# EAGLE design si4735v2.3.1 (EAGLE 9.4.2)
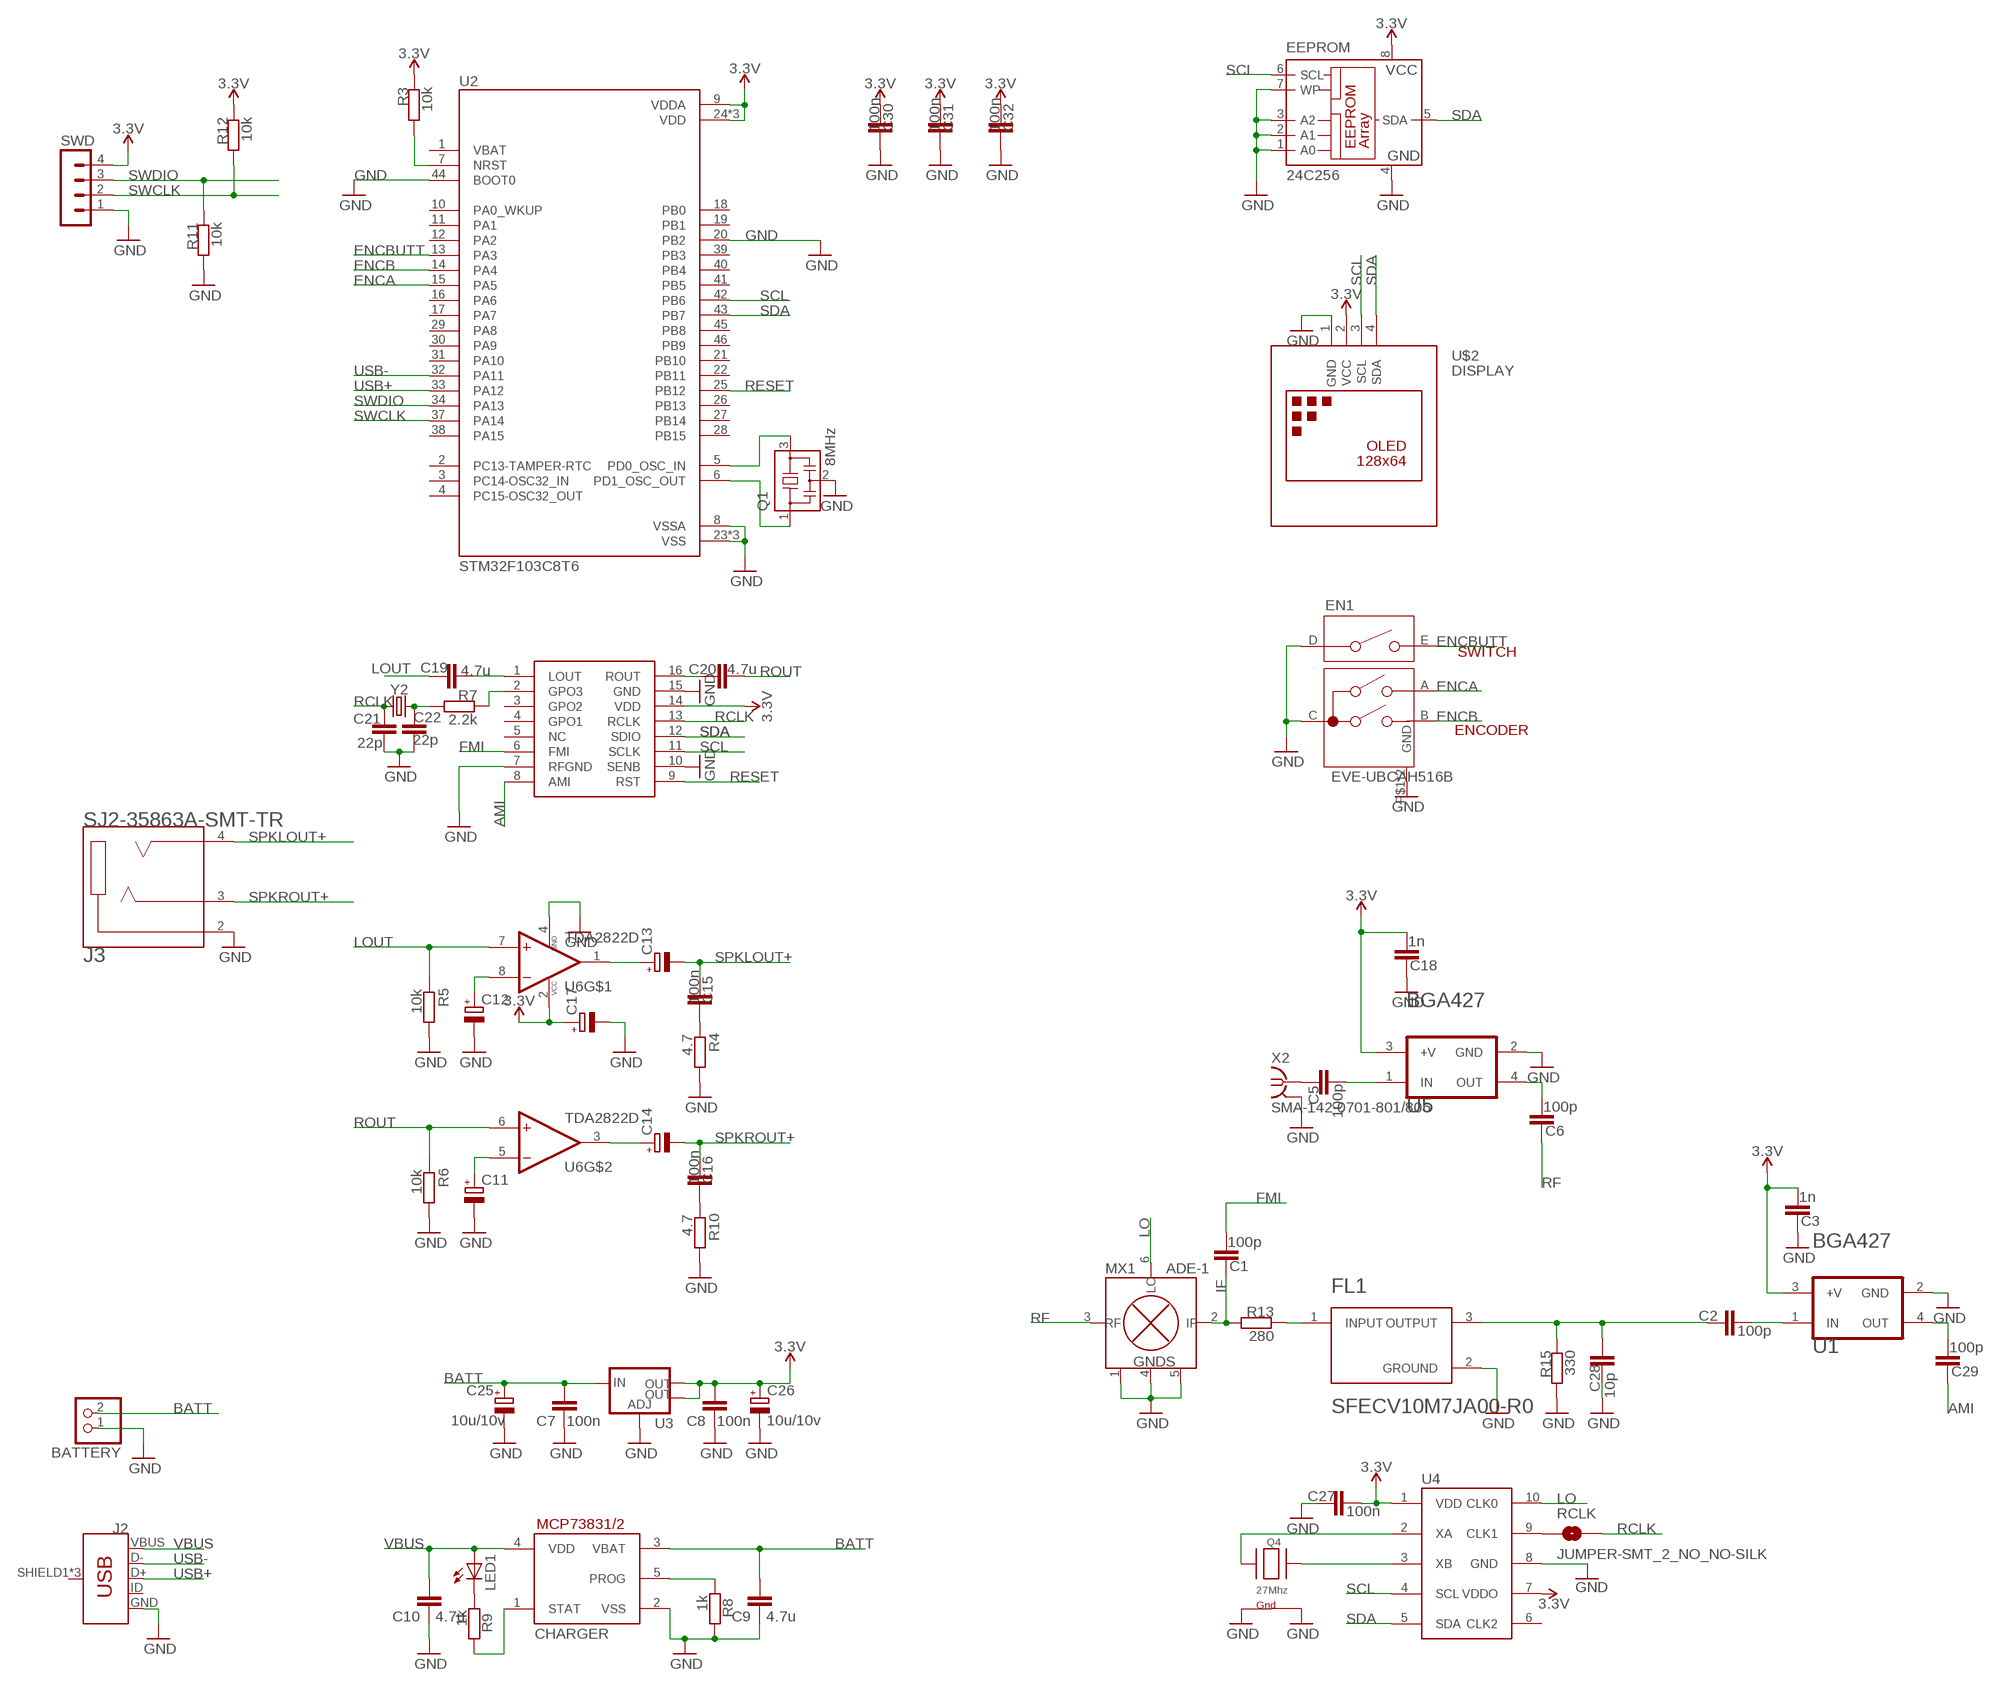
[diagram p0: schematic, sheet 1]

## Parts
BATTERY  PINHD-1X2  [1X02]
C1  100p  C-EUC0805  [C0805]
C2  100p  C-EUC0805  [C0805]
C3  1n  C-EUC0805  [C0805]
C5  100p  C-EUC0805  [C0805]
C6  100p  C-EUC0805  [C0805]
C7  100n  C-EUC0805  [C0805]
C8  100n  C-EUC0805  [C0805]
C9  4.7u  C-EUC0805  [C0805]
C10  4.7u  C-EUC0805  [C0805]
C11  CPOL-EUSMCB  [SMC_B]
C12  CPOL-EUSMCB  [SMC_B]
C13  CPOL-EUSMCB  [SMC_B]
C14  CPOL-EUSMCB  [SMC_B]
C15  100n  C-EUC0805  [C0805]
C16  100n  C-EUC0805  [C0805]
C17  CPOL-EUSMCA  [SMC_A]
C18  1n  C-EUC0805  [C0805]
C19  4.7u  C-EUC0805  [C0805]
C20  4.7u  C-EUC0805  [C0805]
C21  22p  C-EUC0805  [C0805]
C22  22p  C-EUC0805  [C0805]
C25  10u/10v  CPOL-EUA/3216-18W  [A/3216-18W]
C26  10u/10v  CPOL-EUA/3216-18W  [A/3216-18W]
C27  100n  C-EUC0805  [C0805]
C28  10p  C-EUC0805  [C0805]
C29  100p  C-EUC0805  [C0805]
C30  100n  C-EUC0805  [C0805]
C31  100n  C-EUC0805  [C0805]
C32  100n  C-EUC0805  [C0805]
CHARGER  MCP73831/OT  [SOT23-5L]
EEPROM  24C256  24C64SM  [SO-08M]
EN1  EVE-UBCAH516B  [EVE-UBCAH516B]
FL1  MURATA_ELECTRONICS_NORTH_AMERICA_SFECV10M7JA00-R0MURATA_ELECTRONICS_NORTH_AMERICA_SFECV10M7JA00-R0_0_0  [MURATA_ELECTRONICS_NORTH_AMERICA_SFECV10M7JA00-R0_0]
J2  USB_MICRO-BREDUCED_PASTE  [USB-B-MICRO-SMD_RED_PASTE]
J3  SJ2-35863A-SMT-TR  [CUI_SJ2-35863A-SMT-TR]
LED1  LED3MM  [LED3MM]
MX1  ADE-1  [CD636]
Q1  8MHz  CSTCR6M00G53Z  [CSTCR6M]
Q4  27Mhz  XTAL-4-3225  [NX3225]
R3  10k  R-EU_R0805  [R0805]
R4  4.7  R-EU_R0805  [R0805]
R5  10k  R-EU_R0805  [R0805]
R6  10k  R-EU_R0805  [R0805]
R7  2.2k  R-EU_R0805  [R0805]
R8  1k  R-EU_R0805  [R0805]
R9  1k  R-EU_R0805  [R0805]
R10  4.7  R-EU_R0805  [R0805]
R11  10k  R-EU_R0805  [R0805]
R12  10k  R-EU_R0805  [R0805]
R13  280  R-EU_R0805  [R0805]
R15  330  R-EU_R0805  [R0805]
RCLK  JUMPER-SMT_2_NO_NO-SILK  [SMT-JUMPER_2_NO_NO-SILK]
SI4732-A10  SI4732  [SOIC127P600X175-16N]
SWD  MA04-1  [MA04-1]
U1  INFINEON_BGA427INFINEON_BGA427_0_0  [INFINEON_BGA427_0]
U2  STM32F103C8T6  [QFP50P900X900X160-48N]
U3  V_REG_LM1117SOT223  [SOT223]
U4  SI5351A_CLOCK_GEN  [MSOP-10]
U5  INFINEON_BGA427INFINEON_BGA427_0_0  [INFINEON_BGA427_0]
U6  TDA2822D  [SOIC127P600X175-8N]
U$2  DISPLAY  DISPLAY-OLED-128X64-I2C  [DISPLAY-OLED-128X64-I2C]
X2  SMA-142-0701-801/806  [J502-ND-142-0701-801/806]
Y2  CRYSTALSMD-3.2X1.5  [CRYSTAL-SMD-3.2X1.5MM]

## Nets
3.3V: C3.1 C8.2 C17.+ C18.1 C26.+ C27.1 C30.2 C31.2 C32.2 EEPROM.8(VCC) R3.1 R12.1 SI4732-A10.14(VDD) SWD.4 U1.3(+V) U2.9(VDDA) U2.24(VDD) U2.36(VDD) U2.48(VDD) U3.2(OUT) U3.4(OUT) U4.1(VDD) U4.7(VDDO) U5.3(+V) U6.2(VCC) U$2.2(VCC)
AMI: C29.2 SI4732-A10.8(AMI)
BATT: BATTERY.2 C7.2 C9.2 C25.+ CHARGER.3(VBAT) U3.3(IN)
ENCA: EN1.A U2.15(PA5)
ENCB: EN1.B U2.14(PA4)
ENCBUTT: EN1.E U2.13(PA3)
FILTER: C2.2 C28.1 FL1.3(OUTPUT) R15.1
FMI: C1.1 SI4732-A10.6(FMI)
GND: BATTERY.1 C3.2 C7.1 C8.1 C9.1 C10.1 C11.- C12.- C17.- C18.2 C21.1 C22.1 C25.- C26.- C27.2 C28.2 C30.1 C31.1 C32.1 CHARGER.2(VSS) EEPROM.1(A0) EEPROM.2(A1) EEPROM.3(A2) EEPROM.4(GND) EEPROM.7(WP) EN1.C EN1.D EN1.P$1(GND) EN1.P$2(GND) FL1.2(GROUND) J2.GND J3.2(SLEEVE) MX1.1(GND) MX1.4(GND) MX1.5(GND) Q1.2 Q4.2(G2) Q4.4(G1) R4.2 R5.2 R6.2 R8.2 R10.2 R11.2 R15.2 SI4732-A10.7(RFGND) SI4732-A10.10(SENB) SI4732-A10.15(GND) SWD.1 U1.2(GND) U2.8(VSSA) U2.20(PB2) U2.23(VSS) U2.35(VSS) U2.44(BOOT0) U2.47(VSS) U3.1(ADJ) U4.8(GND) U5.2(GND) U6.4(GND) U$2.1(GND) X2.G@1 X2.G@2 X2.G@3 X2.G@4
IF: C1.2 MX1.2(IF) R13.2
LO: MX1.6(LO) U4.10(CLK0)
LOUT: C19.2 R5.1 U6.7(1IN+)
N$1: Q1.3 U2.5(PD0_OSC_IN)
N$2: Q1.1 U2.6(PD1_OSC_OUT)
N$3: CHARGER.5(PROG) R8.1
N$4: C2.1 U1.1(IN)
N$5: RCLK.1 U4.9(CLK1)
N$6: C6.1 U5.4(OUT)
N$7: C5.1 U5.1(IN)
N$9: C12.+ U6.8(1IN-)
N$10: C11.+ U6.5(2IN-)
N$11: Q4.3(X2) U4.3(XB)
N$12: C14.+ U6.3(2OUT)
N$13: Q4.1(X1) U4.2(XA)
N$14: C13.+ U6.1(1OUT)
N$15: C15.1 R4.1
N$16: C19.1 SI4732-A10.1(LOUT)
N$17: C20.1 SI4732-A10.16(ROUT)
N$18: C22.2 R7.2 Y2.P$2
N$19: C16.1 R10.1
N$20: R7.1 SI4732-A10.2(GPO3)
N$21: C5.2 X2.1
N$24: LED1.K(C) R9.1
N$25: CHARGER.1(STAT) R9.2
N$26: C29.1 U1.4(OUT)
N$28: FL1.1(INPUT) R13.1
N$29: R3.2 U2.7(NRST)
RCLK: C21.2 RCLK.2 SI4732-A10.13(RCLK) Y2.P$1
RESET: SI4732-A10.9(RST) U2.25(PB12)
RF: C6.2 MX1.3(RF)
ROUT: C20.2 R6.1 U6.6(2IN+)
SCL: EEPROM.6(SCL) SI4732-A10.11(SCLK) U2.42(PB6) U4.4(SCL) U$2.3(SCL)
SDA: EEPROM.5(SDA) SI4732-A10.12(SDIO) U2.43(PB7) U4.5(SDA) U$2.4(SDA)
SPKLOUT+: C13.- C15.2 J3.4(TIP)
SPKROUT+: C14.- C16.2 J3.3(RING)
SWCLK: R12.2 SWD.2 U2.37(PA14)
SWDIO: R11.1 SWD.3 U2.34(PA13)
USB+: J2.D+ U2.33(PA12)
USB-: J2.D- U2.32(PA11)
VBUS: C10.2 CHARGER.4(VDD) J2.VBUS LED1.A
Unconnected: J2.ID J2.SHIELD1(SHIELD) J2.SHIELD2(SHIELD) J2.SHIELD3(SHIELD) SI4732-A10.3(GPO2) SI4732-A10.4(GPO1) SI4732-A10.5(NC) U2.1(VBAT) U2.2(PC13-TAMPER-RTC) U2.3(PC14-OSC32_IN) U2.4(PC15-OSC32_OUT) U2.10(PA0_WKUP) U2.11(PA1) U2.12(PA2) U2.16(PA6) U2.17(PA7) U2.18(PB0) U2.19(PB1) U2.21(PB10) U2.22(PB11) U2.26(PB13) U2.27(PB14) U2.28(PB15) U2.29(PA8) U2.30(PA9) U2.31(PA10) U2.38(PA15) U2.39(PB3) U2.40(PB4) U2.41(PB5) U2.45(PB8) U2.46(PB9) U4.6(CLK2)

## Library data of the parts
BATTERY = pinhead:PINHD-1X2: PIN HEADER
C1-C3 C5-C10 C15 C16 C18-C22 C27-C32 = rcl:C-EU: CAPACITOR, European symbol; SPICEPREFIX: C
C11-C14 C17 C25 C26 = rcl:CPOL-EU: POLARIZED CAPACITOR, European symbol; SPICEPREFIX: C
CHARGER = adafruit:MCP73831: MCP73831/2 Miniature Single-Cell, Fully Integrated Li-Ion, Li-Polymer Charge Management Controllers. Nice and small simple lipoly charge controller, with adjustable current and status output (LED) http://www.ladyada.net/library/pcb/eaglelibrary.html
EEPROM = microchip:24*: Serial EEPROM I2C; MF: RAMTRON INTERNATIONAL CORP; MPN: FM24C64-S; OC_FARNELL: 9882685; OC_NEWARK: 98H0189
EN1 = Encoders:EVE-UBCAH516B: ROTARY ENCODER MECHANICAL 16PPR Manufacturer's datasheet <https://industrial.panasonic.com/cdbs/www-data/pdf/ATC0000/ATC0000C13.pdf>; CREATED_BY: PCBLayout.com; DIGIKEY_PN: P17058-ND; MANUFACTURER: Panasonic Electronic Components; MPN: EVE-UBCAH516B
FL1 = Murata Electronics North America - SFECV10M7JA00-R0:MURATA_ELECTRONICS_NORTH_AMERICA_SFECV10M7JA00-R0: 10.7MHz Center FM Ceramic Filter 150kHz 330Ohm 2706 (6915 Metric), 3 PC Pad; AUTOMOTIVE: No; BANDWIDTH: 150kHz; CENTROID_NOT_SPECIFIED: No; DATASHEET: https://www.murata.com/ja-jp/products/productdetail.aspx?partno=SFECV10M7JA00-R0; DEVICE_CLASS_L1: Passive Components; DEVICE_CLASS_L2: EMI / RFI Components; DEVICE_CLASS_L3: Ceramic Filters; DIGIKEY_DESCRIPTION: CER FILTER 10.7MHZ FM; DIGIKEY_PART_NUMBER: 490-1230-1-ND; FILTER_TYPE: FM; FOOTPRINT_URL: https://eu.mouser.com/datasheet/2/281/p50e-522732.pdf; FOOTPRINT_VARIANT_NAME_0: Recommended_Land_Pattern; FREQUENCY: 10.7MHz; HEIGHT: 1.7mm; INSERTION_LOSS: 7.5dB; LEAD_FREE: Yes; MF: Murata Electronics North America; MFG_PACKAGE_IDENT: 0; MFG_PACKAGE_IDENT_DATE: 0; MFG_PACKAGE_IDENT_REV: 0; MOUSER_DESCRIPTION: Signal Conditioning 10.7 MHZ CHIP FILTER; MOUSER_PART_NUMBER: 81-SFECV10M7JA; MPN: SFECV10M7JA00-R0; PACKAGE: SMD; PREFIX: FL; ROHS: Yes; TEMPERATURE_RANGE_HIGH: +80°C; TEMPERATURE_RANGE_LOW: -20°C; VERIFICATION_VERSION: 0.0.0.3
J2 = SparkFun-Connectors:USB_MICRO-B: USB Type Micro-B Connector Male/female and PTH/SMT variants SparkFun Products: SparkFun microB USB Breakout <https://www.sparkfun.com/products/12035> SparkFun USB microB Plug Breakout <https://www.sparkfun.com/products/10031> SparkFun ESP8266 Thing <https://www.sparkfun.com/products/13231>; PROD_ID: CONN-11752
J3 = SJ2-35863A-SMT-TR:SJ2-35863A-SMT-TR: 3 conductor, 3.5 mm, SMT Audio Jack Check prices <https://pricing.snapeda.com/parts/SJ2-35863A-SMT-TR/CUI%20Devices/view-part?ref=eda>; AVAILABILITY: Warning; CUI_PURCHASE_URL: https://www.cuidevices.com/product/interconnect/connectors/audio-connectors/jacks/sj2-3586x-smt-series?utm_source=snapeda.com&utm_medium=referral&utm_campaign=snapedaBOM; DESCRIPTION: 3.5 mm, Stereo, Right Angle, Surface Mount (SMT), Audio Jack Connector; MF: CUI Devices; MP: SJ2-35863A-SMT-TR; PACKAGE: None; PRICE: None; PURCHASE-URL: https://pricing.snapeda.com/search/part/SJ2-35863A-SMT-TR/?ref=eda
LED1 = adafruit:LED: LED OSRAM: - CHIPLED LG R971, LG N971, LY N971, LG Q971, LY Q971, LO R971, LY R971 LH N974, LH R974 LS Q976, LO Q976, LY Q976 LO Q996 - Hyper CHIPLED LW Q18S LB Q993, LB Q99A, LB R99A - SideLED LS A670, LO A670, LY A670, LG A670, LP A670 LB A673, LV A673, LT A673, LW A673 LH A674 LY A675 LS A676, LA A676, LO A676, LY A676, LW A676 LS A679, LY A679, LG A679 - Hyper Micro SIDELED® LS Y876, LA Y876, LO Y876, LY Y876 LT Y87S - SmartLED LW L88C, LW L88S LB L89C, LB L89S, LG L890 LS L89K, LO L89K, LY L89K LS L896, LA L896, LO L896, LY L896 - TOPLED LS T670, LO T670, LY T670, LG T670, LP T670 LSG T670, LSP T670, LSY T670, LOP T670, LYG T670 LG T671, LOG T671, LSG T671 LB T673, LV T673, LT T673, LW T673 LH T674 LS T676, LA T676, LO T676, LY T676, LB T676, LH T676, LSB T676, LW T676 LB T67C, LV T67C, LT T67C, LS T67K, LO T67K, LY T67K, LW E67C LS E67B, LA E67B, LO E67B, LY E67B, LB E67C, LV E67C, LT E67C LW T67C LS T679, LY T679, LG T679 LS T770, LO T770, LY T770, LG T770, LP T770 LB T773, LV T773, LT T773, LW T773 LH T774 LS E675, LA E675, LY E675, LS T675 LS T776, LA T776, LO T776, LY T776, LB T776 LHGB T686 LT T68C, LB T68C - Hyper Mini TOPLED® LB M676 - Mini TOPLED Santana® LG M470 LS M47K, LO M47K, LY M47K Source: http://www.osram.convergy.de/
MX1 = minickts:ADE-1: ADE-1 & ADE-1+ Level 7 Mixer, 0.5 - 500 MHz
Q1 = murata-filter:CSTCR: Resonator Source: murata.co.jp; MPN: CSTCR6M00G53-R0; OC_FARNELL: 1170434; OC_NEWARK: 25M8759
Q4 = adafruit:XTAL-4: Classic 4-pin 3.2 x 2.5mm crystal
R3-R13 R15 = rcl:R-EU_: RESISTOR, European symbol; SPICEPREFIX: R
RCLK = SparkFun-Jumpers:JUMPER-SMT_2_NO: Normally open jumper This jumper has two pads in close proximity to each other. Apply solder to close the connection. Round pads are easier to solder for beginners, but are a lot larger. SparkFun Product that uses the round pads: SparkFun EL Sequencer <https://www.sparkfun.com/products/12781>
SI4732-A10 = Si4732:SI4732
SWD = con-lstb:MA04-1: PIN HEADER; OC_FARNELL: unknown; OC_NEWARK: unknown
U1 U5 = Infineon - BGA427:INFINEON_BGA427: INF-BGA427-4; CIIVA_IDS: 12635649; COMPONENT_LINK_1_DESCRIPTION: Manufacturer URL; COMPONENT_LINK_1_URL: http://www.infineon.com/; COMPONENT_LINK_3_DESCRIPTION: Package Specification; COMPONENT_LINK_3_URL: http://www.infineon.com/dgdl/SOT343-Package_Overview.pdf?folderId=db3a30431936bc4b0119535155343cba&fileId=db3a30431936bc4b0119535a9f393cd3; DATASHEET: http://www.infineon.com/dgdl/bga427.pdf?folderId=db3a30431441fb5d0114b654e6581730&fileId=db3a304314dca3890115418dca4d1638&location=en.Products.RF.RF_MMIC.CATV___Broadband_Amplifier.DATASHEET.bga427.pdf; DATASHEET_VERSION: Sep-2011; FOOTPRINT_VARIANT_NAME_0: Manufacturer Recommended; FREQUENCY_F: DC-3 GHz; F_TYP: 2.2 dB; GAIN_TYP: 20 dB; GREEN: yes; HALOGEN_FREE: yes; IMPORTED: yes; IMPORTED_FROM: vault; IMPORT_TS: 1521843782; I_TYP: 9.5 mA; MF: Infineon; MOUNTING_TECHNOLOGY: Surface Mount; MPN: BGA427; PACKAGE: SOT343; PACKAGE_DESCRIPTION: 4-Pin Small Outline Transistor Package, 1.25 x 2 mm Body; PREFIX: U; P_1DB_IN: -3; RELEASE_DATE: 1409237871; VAULT_GUID: 619AC0E0-3DFD-4E37-A691-53F092FDB791; VAULT_REVISION: CFA106F0-95BE-4689-B219-21CB30785EF9
U2 = STM32F103C8T6:STM32F103C8T6: Mainstream Performance line, ARM Cortex-M3 MCU with 64 Kbytes Flash, 72 MHz CPU, motor control, USB and CAN Check prices <https://pricing.snapeda.com/parts/STM32F103C8T6/STMicroelectronics/view-part?ref=eda>; AVAILABILITY: Warning; DESCRIPTION: ARM® Cortex®-M3 STM32F1 Microcontroller IC 32-Bit 72MHz 64KB (64K x 8) FLASH 48-LQFP (7x7); MF: STMicroelectronics; MP: STM32F103C8T6; PACKAGE: LQFP-48 STMicroelectronics; PRICE: None; PURCHASE-URL: https://pricing.snapeda.com/search/part/STM32F103C8T6/?ref=eda
U3 = SparkFun-IC-Power:V_REG_LM1117: Voltage Regulator LM1117 Standard adjustable voltage regulator but in SMD form. Spark Fun Electronics SKU : COM-00595; PROD_ID: VREG-08170
U4 = Tristan+Robitaille's+Library:SI5351A_CLOCK_GEN: Si5351A I2C-PROGRAMMABLE ANY-FREQUENCY CMOS CLOCK GENERATOR + VCXO Technical specifications: Frequency output range: 2.5kHz to 200MHz Supply voltage: 3.3V to 2.5V Current draw: 22mA Datasheet <http://www.silabs.com/Support%20Documents/TechnicalDocs/Si5351-B.pdf> Digi-Key part #: 336-2399-5-ND <http://www.digikey.com/product-detail/en/silicon-labs/SI5351A-B-GT/336-2399-5-ND/3679847> Mouser part #: 634-SI5351A-B-GT <http://ca.mouser.com/ProductDetail/Silicon-Labs/Si5351A-B-GT/?qs=sGAEpiMZZMvo8iywG0hSDWs06v8jDJjKxCv2r5wdINo%3d> Manufacturer part #: SI5351A-B-GT; DIGIKEY#: 336-2399-5-ND; MANF: Si5351A I2C Clock-Gen; MANF#: SI5351A-B-GT; MOUSER#: 634-SI5351A-B-GT
U6 = TDA2822D:TDA2822D: Amplifier IC 1-Channel (Mono) or 2-Channel (Stereo) Class AB 8-SO Check prices <https://pricing.snapeda.com/parts/TDA2822D/STMicroelectronics/view-part?ref=eda>; AVAILABILITY: Good; DESCRIPTION: Amplifier IC 1-Channel (Mono) or 2-Channel (Stereo) Class AB 8-SO; MF: STMicroelectronics; MP: TDA2822D; PACKAGE: SOIC-8 STMicroelectronics; PRICE: None; PURCHASE-URL: https://pricing.snapeda.com/search/part/TDA2822D/?ref=eda
U$2 = diy-modules (1):DISPLAY-OLED-128X64-I2C: 128x64 Dot Matrix OLED Module based on SSD1306 chip Variant with I2C interface More details available here: http://www.instructables.com/id/Monochrome-096-i2c-OLED-display-with-arduino-SSD13/ SSD1306 datasheet: https://cdn-shop.adafruit.com/datasheets/SSD1306.pdf Click here to find device on ebay.com <http://www.ebay.com/sch/oled+display+128x64+iic> Note: There are two variants: I2C and SPI. Search for the proper version.
X2 = con-coax:SMA-: SMA 50 Ohm End Launch Jack Receptacle - Round Contact Johnson Components Source: www.johnsoncomponents.com .. J502-ND.pdf; MF: JOHNSON COMPONENTS; MPN: 142-0701-801; OC_FARNELL: 1608592; OC_NEWARK: 90F2624
Y2 = SparkFun-Clocks:CRYSTAL: Crystals (Generic) These are passive quartz crystals, which can be used as a clock source for a microcontroller. Crystal's are two-terminal devices. They require external "load" capacitors to generate an oscillating signal.

## Board
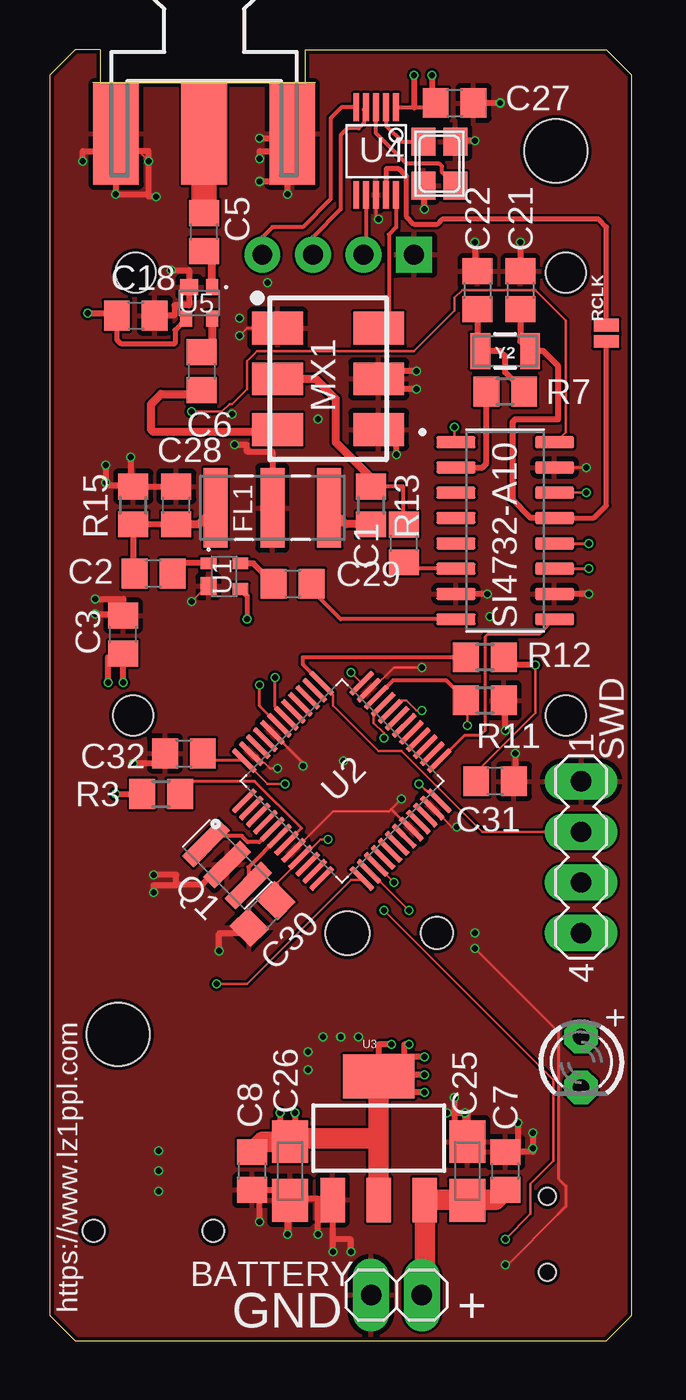
[diagram p1: board, top side]
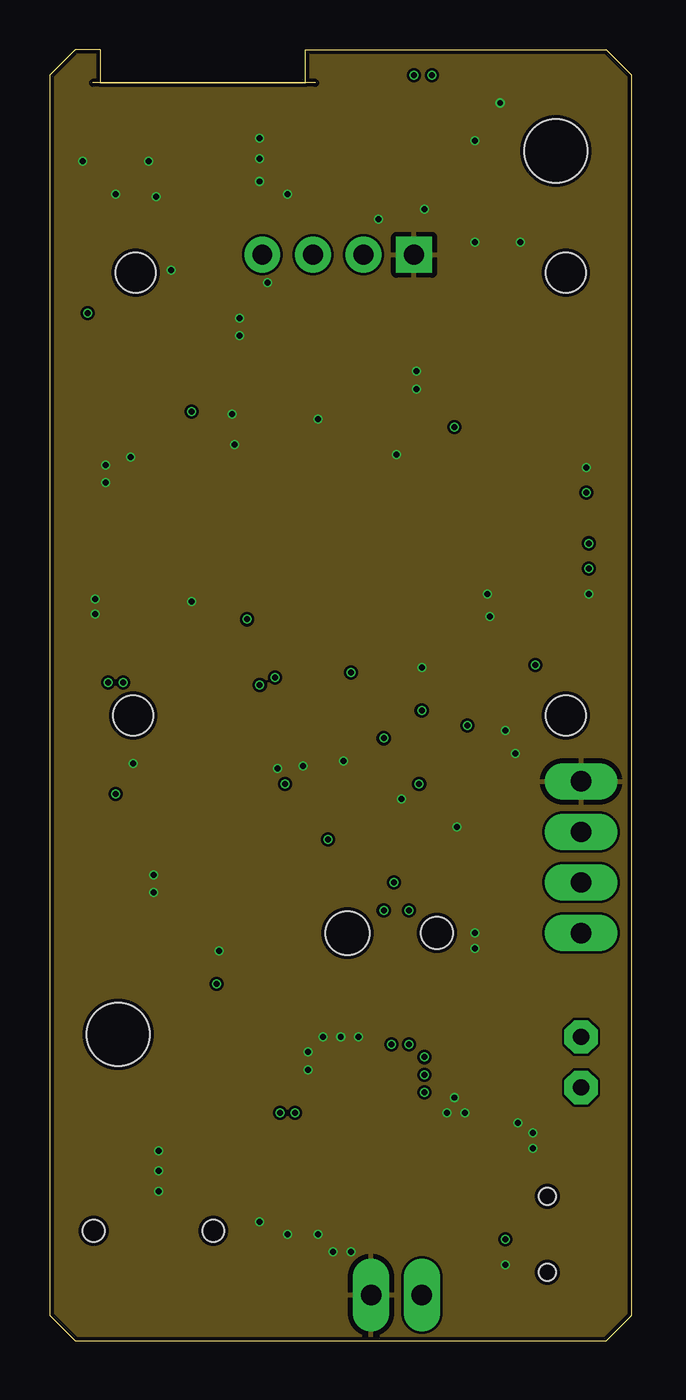
[diagram p2: board, inner layer Route2]
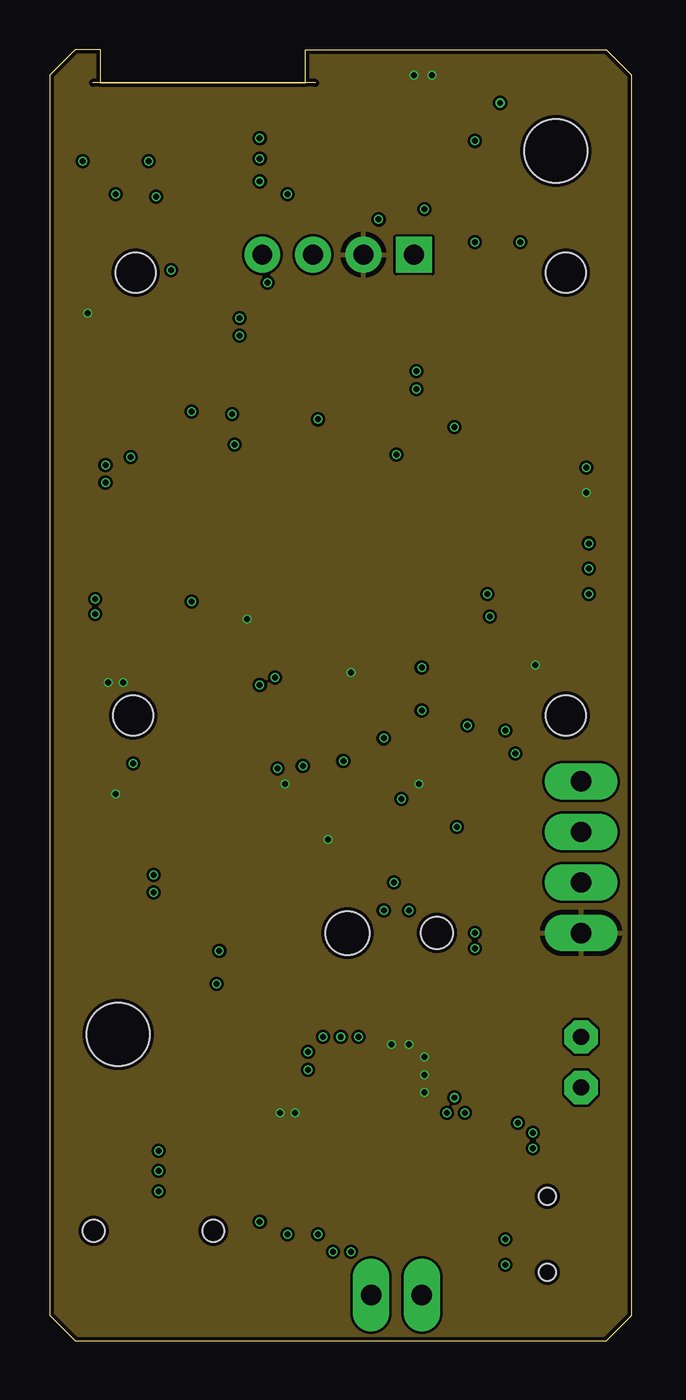
[diagram p3: board, inner layer Route15]
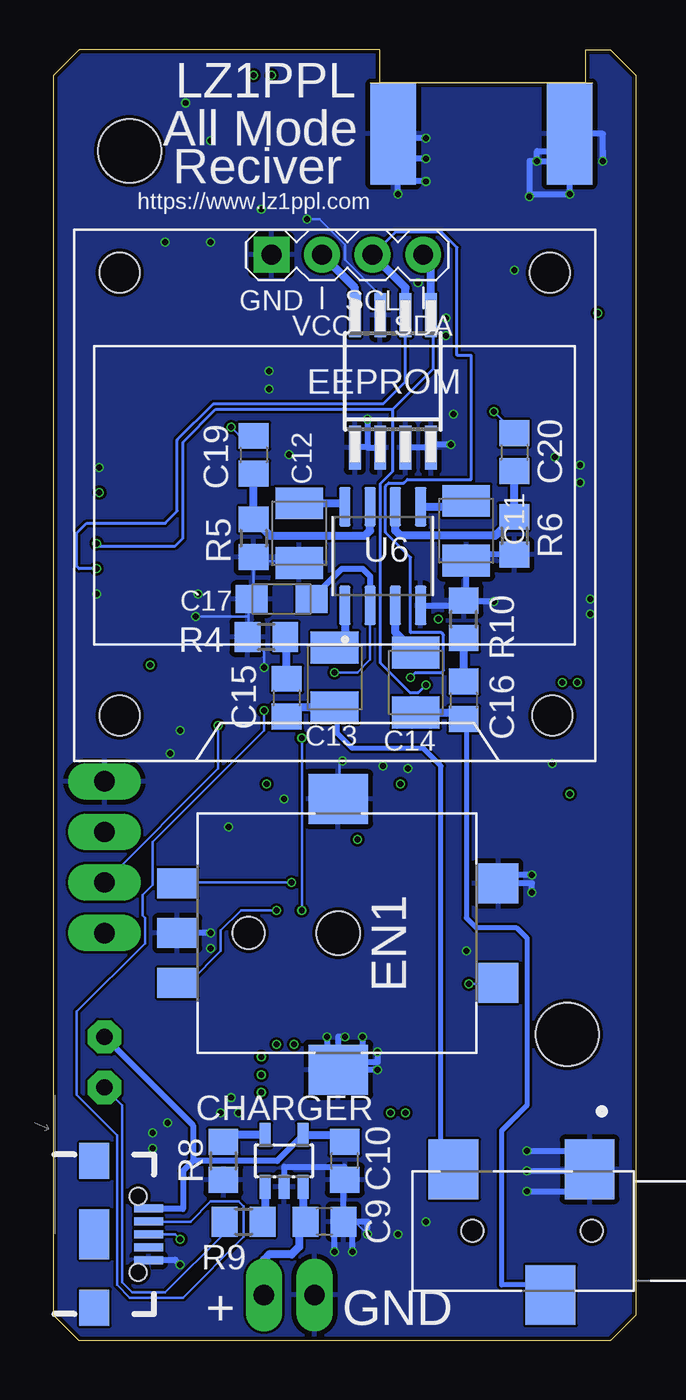
[diagram p4: board, bottom side, seen from below]

Size 29.21 x 64.77 mm. Coordinates in mm from the lower left corner, seen from the top.
Outline: 2.54,64.77 2.54,63.12 12.83,63.12 12.83,64.77 27.94,64.77 29.21,63.5 29.21,1.27 27.94,0 1.27,0 0,1.27 0,63.5 1.27,64.77 2.54,64.77
Copper layers (1+2*15+16): Top 0.035mm / dielectric 0.1mm / Route2 0.0175mm / dielectric 1.265mm / Route15 0.0175mm / dielectric 0.1mm / Bottom 0.035mm
Design rules "jlcpcb-4layers-2313": minimum track width 5mil, minimum drill 0.3mm, track to track 5mil, track to pad 5mil, pad to pad 5mil, via to via 5mil, smd to smd 5mil, copper to edge 0.2mm, drill to drill 6mil, minimum pad ring 10mil, minimum via ring 3mil, stop-mask expansion 4mil, vias tented up to drill 15mil, thermal gap 10mil
Holes 3.17 mm at 3.43,15.37 25.4,59.69

### Footprints (pad centres in the part's own frame; a part is rotated, then mirrored left to right if it is on the bottom)
1X02 = drill 1.016 long: 1 -1.27,0; 2 1.27,0
C0805 = smd 1.3 x 1.5: 1 -0.95,0; 2 0.95,0
SMC_B = smd 1.6 x 2.4: + -1.5,0; - 1.5,0
SMC_A = smd 1.6 x 1.4: + -1.5,0; - 1.5,0
A/3216-18W = smd 2.15 x 1.8: + 1.475,0; - -1.475,0
SOT23-5L = smd 0.55 x 1.2: 1 -0.95,-1.3; 2 0,-1.3; 3 0.95,-1.3; 4 0.95,1.3; 5 -0.95,1.3
SO-08M = smd 0.6 x 2.2: 1 -1.905,-3.33; 2 -0.635,-3.33; 3 0.635,-3.33; 4 1.905,-3.33; 5 1.905,3.33; 6 0.635,3.33; 7 -0.635,3.33; 8 -1.905,3.33
EVE-UBCAH516B = smd 1.5 x 2: A -2.5,-8.078; B 2.5,-8.078; C 0,-8.078 | smd 2 x 2: D -2.5,8.032; E 2.5,8.032 | smd 2.5 x 3: P$1 -6.731,0; P$2 6.858,0 | hole 2.2: 0,0 | hole 1.6: 0,-4.5
MURATA_ELECTRONICS_NORTH_AMERICA_SFECV10M7JA00-R0_0 = smd 1.2 x 4: 1 -2.85,0; 2 0,0; 3 2.85,0
USB-B-MICRO-SMD_RED_PASTE = smd 1.45 x 0.4: D+ 2.725,0; D- 2.725,0.65; GND 2.725,-1.3; ID 2.725,-0.65; VBUS 2.725,1.3 | smd 1.5 x 1.8: SHIELD1 0,3.685; SHIELD2 0,-3.685 | smd 1.5 x 2.5: SHIELD3 0,0 | hole 0.85: 2.2,1.9; 2.2,-1.9
CUI_SJ2-35863A-SMT-TR = smd 2.5 x 3: 2 -2.892,-3.088; 3 -0.927,3.215; 4 3.935,-3.088 | hole 1.1: -3,0; 3,0
LED3MM = drill 0.813 pad 1.676 octagon: A -1.27,0; K 1.27,0
CD636 = smd 1.651 x 2.54: 1 -2.54,-2.54; 2 0,-2.54; 3 2.54,-2.54; 4 2.54,2.54; 5 0,2.54; 6 -2.54,2.54
CSTCR6M = smd 0.8 x 2.6: 1 -1.5,0; 2 0,0; 3 1.5,0
NX3225 = smd 1.4 x 1.2: 1 -1.1,-0.8; 2 1.1,-0.8; 3 1.1,0.8; 4 -1.1,0.8
R0805 = smd 1.3 x 1.5: 1 -0.95,0; 2 0.95,0
SMT-JUMPER_2_NO_NO-SILK = smd 0.635 x 1.27: 1 -0.406,0; 2 0.406,0
SOIC127P600X175-16N = smd 1.97 x 0.6: 1 -2.475,4.445; 2 -2.475,3.175; 3 -2.475,1.905; 4 -2.475,0.635; 5 -2.475,-0.635; 6 -2.475,-1.905; 7 -2.475,-3.175; 8 -2.475,-4.445; 9 2.475,-4.445; 10 2.475,-3.175; 11 2.475,-1.905; 12 2.475,-0.635; 13 2.475,0.635; 14 2.475,1.905; 15 2.475,3.175; 16 2.475,4.445
MA04-1 = drill 1.016 long: 1 -3.81,0; 2 -1.27,0; 3 1.27,0; 4 3.81,0
INFINEON_BGA427_0 = smd 0.8 x 0.6: 1 -0.8,0.65; 3 0.8,-0.65; 4 0.8,0.65 | smd 0.8 x 0.9: 2 -0.8,-0.5
QFP50P900X900X160-48N = smd 1.56 x 0.28: 1 -4.18,2.75; 2 -4.18,2.25; 3 -4.18,1.75; 4 -4.18,1.25; 5 -4.18,0.75; 6 -4.18,0.25; 7 -4.18,-0.25; 8 -4.18,-0.75; 9 -4.18,-1.25; 10 -4.18,-1.75; 11 -4.18,-2.25; 12 -4.18,-2.75; 25 4.18,-2.75; 26 4.18,-2.25; 27 4.18,-1.75; 28 4.18,-1.25; 29 4.18,-0.75; 30 4.18,-0.25; 31 4.18,0.25; 32 4.18,0.75; 33 4.18,1.25; 34 4.18,1.75; 35 4.18,2.25; 36 4.18,2.75 | smd 0.28 x 1.56: 13 -2.75,-4.18; 14 -2.25,-4.18; 15 -1.75,-4.18; 16 -1.25,-4.18; 17 -0.75,-4.18; 18 -0.25,-4.18; 19 0.25,-4.18; 20 0.75,-4.18; 21 1.25,-4.18; 22 1.75,-4.18; 23 2.25,-4.18; 24 2.75,-4.18; 37 2.75,4.18; 38 2.25,4.18; 39 1.75,4.18; 40 1.25,4.18; 41 0.75,4.18; 42 0.25,4.18; 43 -0.25,4.18; 44 -0.75,4.18; 45 -1.25,4.18; 46 -1.75,4.18; 47 -2.25,4.18; 48 -2.75,4.18
SOT223 = smd 1.219 x 2.235: 1 -2.311,-3.099; 2 0,-3.099; 3 2.311,-3.099 | smd 3.6 x 2.2: 4 0,3.099
MSOP-10 = smd 1.4 x 0.3: 1 -2.2,1; 2 -2.2,0.5; 3 -2.2,0; 4 -2.2,-0.5; 5 -2.2,-1; 6 2.2,-1; 7 2.2,-0.5; 8 2.2,0; 9 2.2,0.5; 10 2.2,1
SOIC127P600X175-8N = smd 1.97 x 0.57: 1 -2.475,1.905; 2 -2.475,0.635; 3 -2.475,-0.635; 4 -2.475,-1.905; 5 2.475,-1.905; 6 2.475,-0.635; 7 2.475,0.635; 8 2.475,1.905
DISPLAY-OLED-128X64-I2C = drill 1 square: 1 -3.81,12.7 | drill 1: 2 -1.27,12.7; 3 1.27,12.7; 4 3.81,12.7 | hole 2: -11.43,11.811; 10.16,11.811; 10.287,-10.414; -11.43,-10.414
J502-ND-142-0701-801/806 = smd 5.08 x 2.286: 1 2.565,0; G@1 2.565,4.42; G@2 2.565,-4.42 | smd 5.08 x 2.286 bottom: G@3 2.565,4.42; G@4 2.565,-4.42
CRYSTAL-SMD-3.2X1.5MM = smd 1 x 1.8: P$1 -1.25,0; P$2 1.25,0

### Placement (x,y rotation side)
BATTERY  17.4,2.29 0 top
C1  17.78,40 90 top
C2  5.21,38.48 180 top
C3  3.68,35.43 90 top
C5  7.75,55.63 90 top
C6  7.62,48.64 270 top
C7  22.86,8.51 270 top
C8  10.16,8.51 90 top
C9  15.62,5.97 180 bottom
C10  14.61,9.02 90 bottom
C11  8.51,40.64 270 bottom
C12  16.89,40.51 270 bottom
C13  15.11,33.27 270 bottom
C14  11.05,33.02 270 bottom
C15  17.53,32.26 270 bottom
C16  8.64,32.13 270 bottom
C17  17.78,37.21 180 bottom
C18  4.32,51.43 0 top
C19  19.18,44.45 270 bottom
C20  6.1,44.58 270 bottom
C21  23.62,52.7 270 top
C22  21.46,52.7 270 top
C25  20.95,8.51 270 top
C26  12.06,8.51 90 top
C27  20.32,62.1 0 top
C28  6.35,41.91 90 top
C29  12.19,37.97 0 top
C30  10.68,21.4 45 top
C31  22.35,28.07 180 top
C32  6.73,29.46 0 top
CHARGER  17.65,9.02 0 bottom
EEPROM  12.19,48.13 0 bottom
EN1  14.94,20.45 270 bottom
FL1  11.18,41.78 180 top
J2  27.18,5.33 0 bottom
J3  5.21,5.5 180 bottom
LED1  26.67,13.97 270 top
MX1  13.97,48.26 270 top
Q1  8.91,23.89 135 top
Q4  19.56,59.05 270 top
R3  5.59,27.43 0 top
R4  18.54,35.31 180 bottom
R5  19.18,40.26 270 bottom
R6  6.1,40.39 270 bottom
R7  22.86,47.62 0 top
R8  20.7,9.02 270 bottom
R9  19.68,5.97 0 bottom
R10  8.64,36.2 90 bottom
R11  21.84,32.13 0 top
R12  21.84,34.29 180 top
R13  16.13,41.91 90 top
R15  4.19,41.91 90 top
RCLK  27.94,50.55 270 top
SI4732-A10  22.86,40.64 0 top
SWD  26.67,24.26 270 top
U1  8.76,38.35 0 top
U2  14.66,28.09 45 top
U3  16.51,10.16 0 top
U4  16.38,59.69 270 top
U5  7.49,52.07 270 top
U6  12.7,39.37 90 bottom
U$2  14.48,41.78 0 bottom
X2  7.75,63.12 270 top
Y2  22.86,49.66 180 top

### Tracks (layer width: path | path; a pad name or v marks a point on that pad's centre or on a via)
3.3V  (via drill 0.3)
  Top 0.127: C30.2 11.43,22.1 11.43,22.99 12.57,24.13 U2.9 12.7,24.26 13.59,25.15 v13.97,25.15 | v15.11,33.53 15.62,33.02 U2.36 | v24.38,33.91 24.38,31.5 21.46,28.57 21.46,28.07 C31.2 | v18.54,27.94 18.82,27.66 U2.24 | v26.92,42.54 SI4732-A10.14 | v11.81,27.94 10.92,27.94 9.78,29.08 U2.48 | 3.68,34.29 C3.1
  Top 0.152: U2.48 8.04,29.1 C32.2
  Top 0.203: U4.1 18.29,61.89 19.16,61.89 19.27,62.01 C27.1 | U4.7 15.88,54.62 U$2.2
  Top 0.254: U1.3 9.91,37.36 v9.91,36.2 | C18.1 3.37,50.23 3.56,50.04 6.29,50.04 6.29,50.72 U5.3
  Top 0.305: v18.29,63.5 18.29,61.89 | v19.18,63.5 19.18,62.01 19.27,62.01 | v1.91,51.56 3.37,51.56 C18.1 | v3.68,33.02 3.68,34.29 2.92,34.29 v2.92,33.02 | v3.3,27.43 R3.1 | v18.8,12.45 16.51,12.45 U3.4 | v18.8,13.33 17.78,13.33 | 17.78,13.33 16.51,13.33 | 16.51,13.33 U3.4 | v18.8,14.22 16.51,14.22 16.51,13.33 | v18.03,14.86 17.78,14.86 17.78,13.33 | v17.14,14.86 16.51,14.86 U3.4 | v24.38,33.91 22.79,33.91 R12.1 | v11.56,11.43 11.56,9.98 C26.+ 12.32,9.98 v12.32,11.43
  Top 1.016: U3.2 16.51,10.16 | 16.51,10.16 U3.4 | 16.51,10.16 12.24,10.16 C26.+ 10.68,9.98 C8.2
  Bottom 0.127: U6.2 13.33,34.16 13.97,33.53 v15.11,33.53
  Bottom 0.305: C17.+ 14.76,38.73 13.72,38.73 13.33,38.35 U6.2
  Bottom 0.406: EEPROM.8 14.1,52.83 U$2.2
  pour Route15: 0,64.77 27.94,64.77 29.21,63.5 29.21,1.27 27.94,0 1.27,0 0,1.27
AMI
  Top 0.203: SI4732-A10.8 14.61,36.2 13.14,37.66
  Top 0.254: 13.14,37.66 C29.2
BATT
  Top 1.016: BATTERY.2 18.82,2.44 U3.3 20.93,7.06 | 20.93,7.06 C25.+ | C7.2 22.36,7.06 20.93,7.06
  Bottom 0.406: CHARGER.3 16.7,6.1 C9.2 16.89,5.65 16.89,4.7 17.27,4.32 18.41,4.32 18.67,4.06 BATTERY.2
ENCA  (via drill 0.3)
  Top 0.127: v17.27,22.99 16.38,23.88 U2.15
  Bottom 0.127: v17.27,22.99 22.99,22.99 EN1.A
ENCB  (via drill 0.3)
  Top 0.127: v18.03,21.59 16.13,23.49 U2.14
  Bottom 0.127: v18.03,21.59 19.81,21.59 20.83,20.57 20.83,19.56 22.35,18.03 22.99,18.03 EN1.B
ENCBUTT  (via drill 0.3)
  Top 0.127: v8.38,17.91 9.91,17.91 15.11,23.11 15.62,23.11 U2.13
  Bottom 0.127: v8.38,17.91 6.94,17.91 EN1.E
FILTER
  Top 0.305: C2.2 4.19,38.55 R15.1 C28.1
  Top 0.406: C28.1 7.5,40.96 FL1.3
FMI
  Top 0.203: SI4732-A10.6 18.1,38.73 C1.1
GND  (via drill 0.3)
  Top 0.127: v18.67,33.78 17.27,33.78 16.13,32.64 U2.35 | v7.11,37.08 7.87,37.85 U1.2 | U4.8 16.38,56.39 v16.51,56.26 | 18.8,57.91 Q4.2 | 20.45,60.2 Q4.4 | 25.53,6.35 22.99,3.81 v22.86,3.81 | v21.34,19.68 25.53,15.49 | 9.91,20.45 9.91,20.7 C30.1 | 23.37,28.07 C31.1 | 22.86,31.75 22.86,32.13 R11.2 | 4.19,42.93 3.81,42.93 2.92,42.93 v2.79,43.05 | 4.19,42.93 6.35,42.93 C28.2 | 4.19,42.93 R15.2 | v17.65,27.18 17.14,26.67 17.02,26.54 14.22,26.54 12.32,24.64 U2.8 | v11.43,28.7 11.05,28.7 10.41,29.34 10.16,29.34 U2.47 | v20.45,25.78 20.19,25.78 19.3,26.67 U2.23 | v26.92,43.81 SI4732-A10.15 | v11.94,5.33 12.06,5.46 C26.- 12.06,7.11 12.7,7.11 | 20.95,10.16 C25.- | MX1.1 9.91,50.8 v9.53,50.42 | 8.89,23.88 Q1.2 | 11.18,41.91 FL1.2 | v4.95,59.18 3.68,60.45 3.43,60.45 X2.G@4
  Top 0.152: 25.53,15.49 25.54,15.48 25.54,8.12 25.91,7.75 25.91,6.73 25.53,6.35 | U2.44 12.7,28.99 v12.7,28.83 | U2.20 17.14,26.66 17.14,26.67
  Top 0.305: v1.65,59.18 1.65,59.69 3.3,59.69 | 3.3,59.69 v3.3,57.53 4.95,57.53 | 3.3,59.69 4.95,59.69 v4.95,59.18 4.95,57.53 | 4.95,57.53 4.95,57.4 5.27,57.4 | X2.G@3 12.17,60.32 11.94,60.32 | v11.94,57.53 11.94,58.17 | 11.94,59.69 11.94,60.32 | v10.54,59.31 10.54,59.69 11.94,59.69 | v10.54,60.32 11.94,60.32 | v10.54,58.17 11.94,58.17 | 11.94,58.17 11.94,59.69 | v18.8,56.77 18.8,57.91 | v21.34,60.2 20.45,60.2 | v22.61,62.1 C27.2 | v21.34,55.12 21.34,53.65 C22.1 | v23.62,55.12 C21.1 | v18.41,47.75 16.51,47.75 MX1.5 16.51,48.64 v18.41,48.64 | v17.4,44.45 17.4,45.72 MX1.4 | v9.27,44.96 9.88,44.96 9.88,44.61 11.18,44.61 11.18,41.91 | v4.06,44.32 4.06,42.93 3.81,42.93 | v2.79,43.94 v2.79,43.05 2.79,42.93 4.19,42.93 | R15.2 C28.2 | v6.1,53.72 6.99,53.72 U5.2 6.99,51.95 6.26,51.95 6.26,51.43 C18.2 | v2.29,37.21 3.68,37.21 3.68,36.45 | 3.68,36.45 C3.2 | v2.29,36.45 3.68,36.45 | C32.1 5.78,28.96 v4.19,28.96 | v5.21,23.37 6.35,23.37 6.35,22.86 | Q1.2 8.65,23.89 7.62,22.86 6.35,22.86 | v5.21,22.48 5.21,22.86 6.35,22.86 | v8.51,19.56 8.51,20.45 9.91,20.45 | v20.83,11.43 20.83,10.16 | 20.83,10.16 20.95,10.16 | v20.32,12.19 20.32,10.16 20.83,10.16 | v19.94,11.43 20.95,11.43 C25.- | v24.26,10.41 v24.26,9.65 24.26,9.46 C7.1 23.5,9.46 v23.5,10.92 | v11.94,5.33 11.94,7.11 12.06,7.11 | U3.1 14.2,7.11 | 13.46,7.11 12.7,7.11 12.7,7.56 C8.1 10.54,7.56 v10.54,5.97 | v13.46,5.33 13.46,7.11 | 13.46,7.11 14.2,7.11 | v14.22,4.44 14.22,5.08 | 14.22,5.08 14.22,7.11 14.2,7.11 | v15.11,4.44 15.11,5.08 14.22,5.08 | v23.37,29.46 23.37,28.07 | v22.86,30.61 22.86,31.75 | v27.05,37.46 SI4732-A10.10 | v21.97,37.46 SI4732-A10.7
  Bottom 0.127: 19.18,39.12 19.18,37.21 C17.- 19.3,37.21 19.43,37.08 19.43,36.32 | 19.18,39.12 R5.2 | 19.43,36.32 19.43,35.31 | v18.67,33.78 18.67,34.54 19.43,35.31 | 19.43,35.31 R4.2 | 19.18,39.12 16.89,39.12 C12.- | 17.65,8 CHARGER.2 | 14.61,8.13 C10.1 14.61,5.97 | 20.7,8.13 R8.2 | 13.97,44.83 14.1,44.83 EEPROM.1 | 13.46,44.83 12.83,44.83 EEPROM.2 | 24.57,4.06 24.5,4.03 J2.GND | v7.11,37.08 8.51,37.08 | 8.51,37.08 8.64,37.08 R10.2 8.51,37.08 | 14.61,5.97 14.1,5.97 v13.46,5.33 | v9.27,44.96 9.4,44.83 | EEPROM.7 12.83,52.45 14.61,54.23 14.61,54.99 15.88,56.26 v16.51,56.26 | 8.51,37.08 C11.- | v14.73,29.08 14.86,28.96 14.86,27.18 EN1.P$1 | 14.61,5.97 C9.1 | v22.1,36.32 19.43,36.32 | 12.06,60.45 X2.G@3
  Bottom 0.305: v5.46,8.51 2.32,8.51 | 2.32,8.51 2.29,8.51 | 2.32,8.51 J3.2 | v5.46,7.49 2.29,7.49 2.29,8.51 | v5.46,9.53 2.29,9.53 2.29,8.51 | v14.22,4.44 14.22,5.97 C9.1 | v13.46,5.33 13.46,5.97 C9.1 | v15.11,4.44 15.11,5.97 C9.1 | v22.86,3.81 23.11,4.06 24.57,4.06 | C9.1 14.67,8.13 14.61,8.13 14.61,7.72 14.62,7.72 14.62,8.72 17.64,8.72 17.64,7.72 CHARGER.2 | 20.7,8.51 20.7,8.13 | v14.61,15.24 14.94,15.24 14.94,13.97 | v15.49,15.24 15.49,13.59 EN1.P$2 | v13.72,15.24 13.72,13.59 EN1.P$2 | v12.95,14.48 12.95,13.97 14.94,13.97 | v12.95,13.59 EN1.P$2 | EN1.P$2 14.94,13.97 | v21.34,20.45 EN1.C | v5.21,22.48 5.21,22.95 EN1.D 6.9,23.37 v5.21,23.37 | v7.11,37.08 8.64,37.08 8.64,36.89 U6.4 | R10.2 8.51,37.14 C11.- 8.51,39.44 R6.2 | v9.27,44.96 10.29,44.96 EEPROM.4 EEPROM.3 | EEPROM.2 13.46,44.8 v13.46,46.23 13.46,44.83 13.97,44.83 | v11.94,57.53 11.94,58.17 | 11.94,59.31 11.94,60.32 | 12.06,60.45 11.94,60.45 11.94,60.32 | v10.54,58.17 11.94,58.17 | 11.94,58.17 11.94,59.31 | v10.54,59.31 11.94,59.31 | v10.54,60.32 11.94,60.32 | 1.65,59.69 v1.65,59.18 1.65,60.55 X2.G@4 3.33,59.18 v4.95,59.18 | v4.95,59.18 4.95,59.69 3.3,59.69 v3.3,57.53 5.33,57.53 v5.33,57.4 5.33,59.18 v4.95,59.18
  other vias: 9.53,51.31 9.14,46.48 10.92,53.09
  pour Route2: 0,64.77 27.94,64.77 29.21,63.5 29.21,1.27 27.94,0 1.27,0 0,1.27
  pour Top: 1.27,64.77 2.54,64.77 2.54,63.5 12.7,63.5 12.7,64.77 27.94,64.77 29.21,63.5 29.21,1.27 27.94,0 1.27,0 0,1.27 0,63.5
  pour Bottom: 1.27,64.77 2.54,64.77 2.54,63.5 12.7,63.5 12.7,64.77 27.94,64.77 29.21,63.5 29.21,1.27 27.94,0 1.27,0 0,1.27 0,63.5
IF
  Top 0.203: R13.2 17.72,42.86 17.72,41.02 C1.2
  Top 0.406: MX1.2 13.33,48.26 14.35,47.24 14.35,45.09 16.13,43.31 R13.2
LO
  Top 0.203: U4.10 17.38,55.86 17.02,55.5 17.02,51.31 MX1.6
LOUT
  Bottom 0.406: U6.7 13.33,40.64 13.59,40.39 18.35,40.39 R5.1 C19.2
N$1
  Top 0.203: U2.5 10.53,25.02 9.94,25.02 9.64,25.32 8.21,25.32 Q1.3
N$2
  Top 0.203: U2.6 9.97,23.75 Q1.1
N$3
  Bottom 0.406: CHARGER.5 20.35,10.32 R8.1
N$4
  Top 0.305: U1.1 6.68,39 C2.1
N$5
  Top 0.254: RCLK.1 27.94,55.88 27.56,56.26 19.68,56.26 19.43,56.01 18.29,56.01 17.9,56.39 17.9,58.42 17.52,58.8 16.89,58.8 16.88,58.79 U4.9
N$6
  Top 0.406: U5.4 8.14,50.11 C6.1
N$7
  Top 0.406: U5.1 8.14,54.28 C5.1
N$9
  Bottom 0.406: U6.8 14.77,42.01 C12.+
N$10
  Bottom 0.406: U6.5 8.8,41.84 C11.+
N$11
  Top 0.203: Q4.3 19.68,58.63 19.68,58.93 19.56,59.05 17.91,59.05 16.38,60.58 U4.3
N$12
  Bottom 0.406: C14.+ 12.06,35.54 U6.3
N$13
  Top 0.203: U4.2 16.88,60.97 17.7,60.15 Q4.1
N$14
  Bottom 0.406: U6.1 14.61,35.28 C13.+
N$15
  Bottom 0.406: C15.1 17.53,35.24 R4.1
N$16  (via drill 0.3)
  Top 0.127: v20.32,45.85 20.32,45.09 SI4732-A10.1
  Bottom 0.127: v20.32,45.85 19.94,45.47 19.18,45.47 C19.1
N$17  (via drill 0.3)
  Top 0.127: v7.11,46.61 8.64,46.61 9.02,46.99 9.14,46.99 9.91,47.75 9.91,49.15 10.41,49.66 18.29,49.66 20.32,51.69 20.32,52.32 20.7,52.7 24.38,52.7 25.91,51.18 25.91,45.59 25.4,45.09 SI4732-A10.16
  Bottom 0.127: v7.11,46.61 6.1,45.59 C20.1
N$18
  Top 0.305: R7.2 22.86,48.57 22.86,49.4 22.61,49.66 Y2.P$2 21.46,49.8 C22.2
N$19
  Bottom 0.406: C16.1 R10.1
N$20
  Top 0.305: SI4732-A10.2 21.72,43.81 21.91,44.01 R7.1
N$21
  Top 1.27: C5.2 X2.1
N$24
  Bottom 0.127: LED1.K 25.78,11.81 25.78,2.92 25.27,2.41 23.62,2.41 20.7,5.33 20.7,5.97 R9.1
N$25
  Bottom 0.406: CHARGER.1 18.6,6.1 R9.2
N$26
  Top 0.305: U1.4 10.21,39 C29.1
N$28
  Top 0.406: R13.1 14.85,40.96 FL1.1
N$29
  Top 0.152: U2.7 12.64,25.71 10.29,28.07 7.17,28.07 R3.2
RCLK
  Top 0.254: SI4732-A10.13 27.3,41.27 27.94,41.91 RCLK.2
  Top 0.305: C21.2 23.62,50.15 Y2.P$1 24.77,49.66 25.53,48.9 25.53,46.23 23.37,46.23 23.24,46.1 23.24,42.16 24.13,41.27 SI4732-A10.13
RESET
  Top 0.152: SI4732-A10.9 24.57,35.43 21.97,35.43 21.84,35.31 21.84,30.61 21.59,30.35 20.81,30.35 U2.25
RF
  Top 0.406: MX1.3 11.3,45.59 5.21,45.59 5.08,45.72 5.08,46.99 5.59,47.5 7.43,47.5 C6.2
ROUT
  Bottom 0.406: U6.6 12.06,40.64 11.81,40.39 7.05,40.39 R6.1 C20.2
SCL  (via drill 0.3)
  Top 0.152: SI4732-A10.11 v27.05,38.73 | U2.42 11.3,31.8 v11.3,33.27
  Top 0.203: U4.4 15.76,61.77 15.76,61.09 15.5,60.83 14.95,60.83 14.61,60.48 14.61,56.77 13.21,55.37 U$2.3
  Bottom 0.152: v27.05,38.73 27.94,38.73 28.07,38.86 28.07,40.51 27.56,41.02 23.62,41.02 23.01,41.63 23.01,45.2 21.2,47.02 12.67,47.02 11.56,48.13 EEPROM.6 | v11.3,33.27 11.06,33.52 9.76,33.52 9.65,33.64 9.65,35.4 9.76,35.52 11.3,35.52 11.3,39.3 12.55,40.55 12.55,42.87 12.39,43.03 11.64,43.03 11.46,43.21 8.26,43.21 8.26,49.44 8.97,49.44 8.97,54.85 9.74,55.63 12.06,55.63 U$2.3
  Bottom 0.406: EEPROM.6 11.56,52.83 U$2.3
SDA  (via drill 0.3)
  Top 0.152: SI4732-A10.12 v27.05,40 | U2.43 10.54,31.85 v10.54,32.89
  Top 0.203: U4.5 14.65,61.89 14.1,61.34 14.1,57.28 12.7,55.88 11.18,55.88 10.67,55.37 U$2.4
  Bottom 0.152: v27.05,40 26.92,39.88 23.11,39.88 22.73,40.26 22.73,45.09 21.08,46.74 12.19,46.74 | 12.19,46.74 10.16,48.77 10.16,51.34 EEPROM.5 | 12.19,46.74 12.19,43.63 12.83,42.99 12.83,34.02 11.34,32.52 10.91,32.52 v10.54,32.89
  Bottom 0.406: EEPROM.5 10.29,54.1 U$2.4
SPKLOUT+
  Bottom 0.254: J3.4 9.78,9.22 9.78,28.83 10.67,29.72 14.22,29.72 14.99,30.48 14.99,31.65 C13.-
  Bottom 0.406: C13.- 17.06,31.77 C15.2
SPKROUT+
  Bottom 0.254: C16.2 8.51,31.05 8.51,21.21 8,20.7 5.97,20.7 5.46,20.19 5.46,11.81 6.73,10.54 6.73,2.79 4.79,2.79 J3.3
  Bottom 0.406: C14.- 8.97,31.52 C16.2
SWCLK
  Top 0.127: SWD.2 21.72,25.53 17.65,29.59 16.51,29.59 14.22,31.88 14.22,32.38 13.72,32.89 U2.37
  Top 0.203: U2.37 12.7,33.93 12.7,34.29 R12.2
SWDIO  (via drill 0.3)
  Top 0.127: v20.95,30.86 20.95,32.13 R11.1
  Top 0.203: U2.34 17.24,33.15 19.88,33.15 R11.1
  Bottom 0.127: v20.95,30.86 20.95,28.7 SWD.3
USB+  (via drill 0.3)
  Top 0.127: v22.86,5.08 24.13,6.35 24.13,7.87 25.27,9.02 25.27,13.08 v16.76,21.59 | v16.76,30.23 16.76,30.48 16.26,30.99 16.26,31.5 16.64,31.88 U2.33
  Bottom 0.127: v22.86,5.08 23.11,5.33 J2.D+ | v16.76,30.23 v16.76,21.59
USB-  (via drill 0.3)
  Top 0.127: v18.67,31.62 18.41,31.62 17.91,32.13 17.65,32.13 17.14,31.62 U2.32
  Bottom 0.127: v18.67,31.62 18.67,30.61 24.26,25.02 24.26,22.86 24.77,22.35 24.77,21.34 24.64,21.21 24.64,19.94 28.07,16.51 28.07,12.32 26.04,10.29 26.04,2.79 25.4,2.16 22.73,2.16 19.68,5.21 19.68,6.73 19.94,6.99 21.34,6.99 22.35,5.97 24.44,5.97 J2.D-
VBUS
  Bottom 0.305: CHARGER.4 18,9.02 22.22,9.02 | J2.VBUS 24.42,6.6 22.73,6.6 22.73,8.51 22.22,9.02 | 22.22,9.02 22.22,10.79 LED1.A
  Bottom 0.406: CHARGER.4 14.96,10.32 C10.2

### Text on the board
tNames: https://www.lz1ppl.com | GND | +
bNames: LZ1PPL | All Mode | Reciver | https://www.lz1ppl.com | GND | +